# EAGLE schematic Smart_car_Parking_v1 (EAGLE 9.7.0)
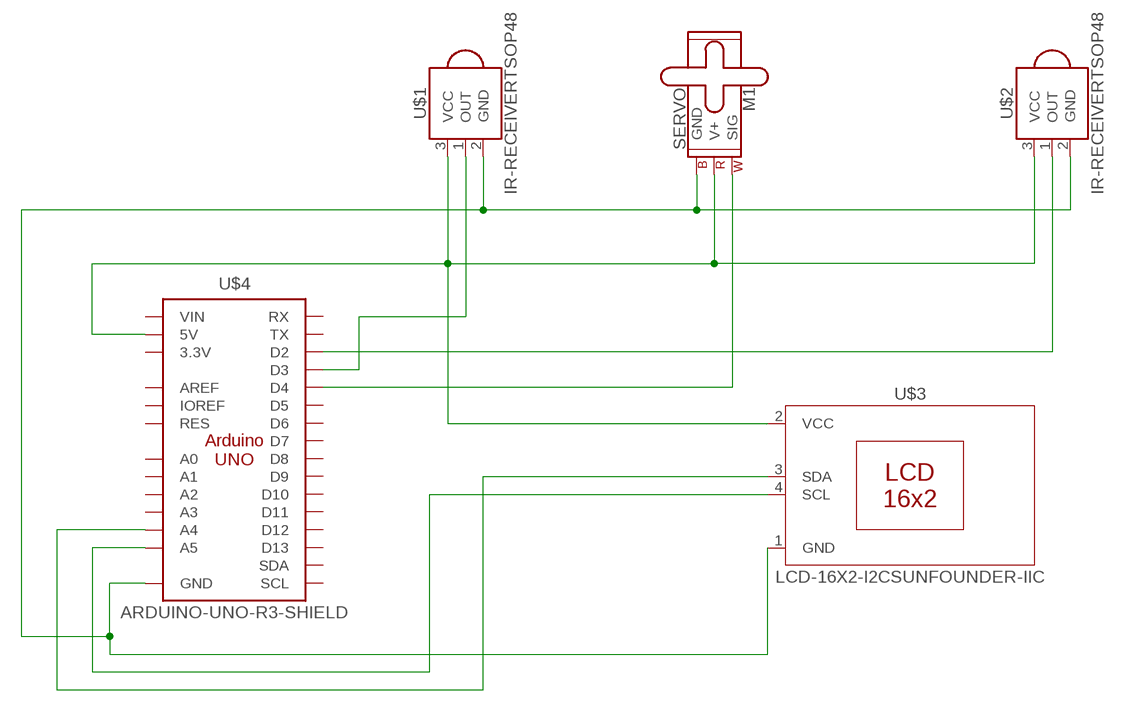
[diagram p0: schematic, sheet 1]

## Parts
M1  SERVO  [1X03]
U$1  IR-RECEIVERTSOP48  [TSOP48]
U$2  IR-RECEIVERTSOP48  [TSOP48]
U$3  LCD-16X2-I2CSUNFOUNDER-IIC  [LCD-I2C]
U$4  ARDUINO-UNO-R3-SHIELD  [ARDUINO-UNO-R3-SHIELD]

## Nets
N$1: U$3.3(SDA) U$4.A4
N$2: U$3.4(SCL) U$4.A5
N$3: M1.2(V+) U$1.3(VCC) U$2.3(VCC) U$3.2(VCC) U$4.5V
N$4: M1.3(GND) U$1.2(GND) U$2.2(GND) U$3.1(GND) U$4.GND@0(GND) U$4.GND@1(GND) U$4.GND@2(GND)
N$5: U$2.1(OUT) U$4.D2
N$6: U$1.1(OUT) U$4.D3
N$7: M1.1(SIG) U$4.D4
Unconnected: U$4.3.3V U$4.A0 U$4.A1 U$4.A2 U$4.A3 U$4.AREF U$4.D5 U$4.D6 U$4.D7 U$4.D8 U$4.D9 U$4.D10 U$4.D11 U$4.D12 U$4.D13 U$4.IOREF U$4.RES U$4.RX U$4.SCL U$4.SDA U$4.TX U$4.VIN

## Library data of the parts
M1 = SparkFun-Electromechanical:SERVO: Servo Motor 3-pin connector for a standard servo motor (voltage supply, ground, and control signal.) SparkFun Products Servo - Generic (Sub-Micro Size) <https://www.sparkfun.com/products/9065> (ROB-09065) Servo - Generic High Torque Continuous Rotation (Standard Size) <https://www.sparkfun.com/products/9347> (ROB-09347) Servo - Generic High Torque (Standard Size) <https://www.sparkfun.com/products/11965> (ROB-11965)
U$1 U$2 = Tinkercad:IR-RECEIVER
U$3 = Tinkercad:LCD-16X2-I2C
U$4 = Tinkercad:ARDUINO-UNO-R3-SHIELD